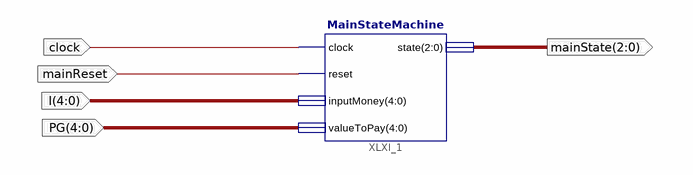
[diagram p0: schematic sheet 1]
// Xilinx ISE schematic GeneralSchematic.sch (artix7) as structural Verilog: 1 symbols, 5 ports
module GeneralSchematic (
  input  [4:0] I,
  input  [4:0] PG,
  input  mainReset,
  input  clock,
  output [2:0] mainState
);

  MainStateMachine XLXI_1 (.clock(clock), .reset(mainReset), .inputMoney(I), .valueToPay(PG), .state(mainState));
endmodule
